# Altium schematic sheet EIS_Main_Akku.SchDoc: EIS: Akkulader und Überwachung
size A4; FaxNumber: +49 7721 943 210; Organization: Hahn-Schickard; Address1: Wilhelm-Schickard-Str. 10; Address2: 78052 Villingen-Schwenningen; Address3: Bernd.Ehrbrecht@Hahn-Schickard.de; DocumentNumber: 1; Revision: 1.0; SheetNumber: 4; SheetTotal: 7; PhoneNumber: 0 7721 943 137; E-Mail: Xxxx.Xxxx@Hahn-Schickard.de; PageSetup: Record=PageOptions|CenterHorizontal=True|CenterVertical=True|PrintScale=0.97|XCorrection=1.00|YCorrection=1.00|PrintKind=0|BorderSize=5000000|LeftOffset=0|BottomOffset=0|Orientation=2|PaperLength=1000|PaperWidth=1000|Scale=100|PaperSource=7|PrintQuality=-3|MediaType=1|DitherType=10|PrintScaleMode=1|PaperKind=A4|PaperIndex=9; ProjectName: Project File Name
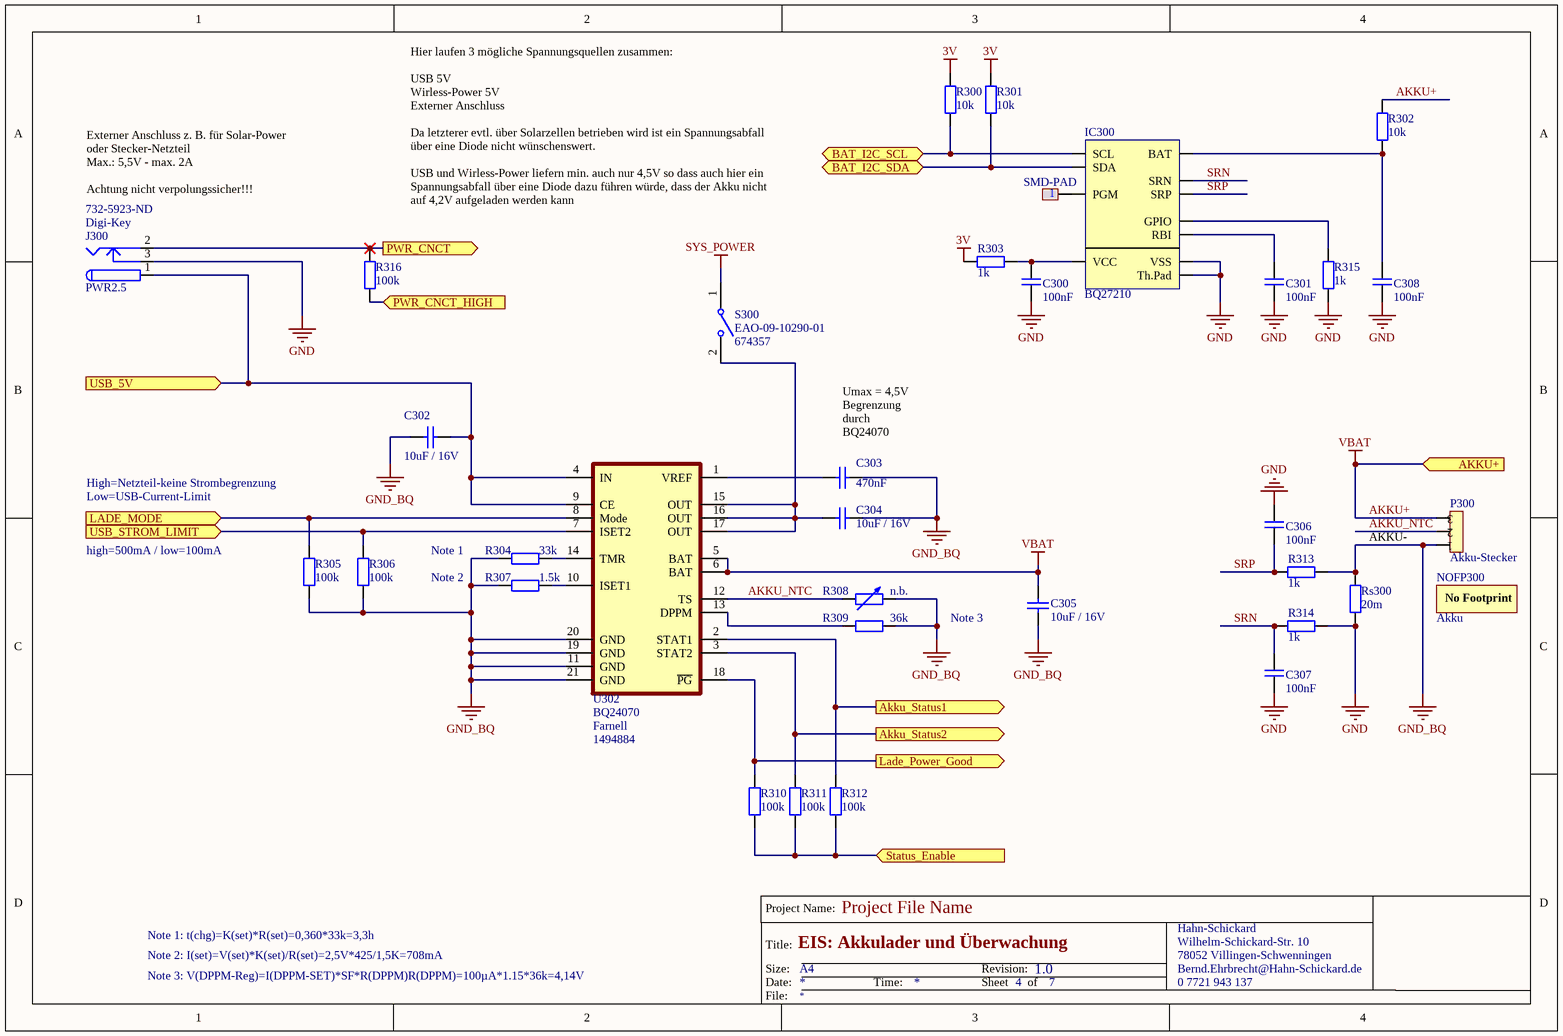
[diagram p0: EIS_Main_Akku.SchDoc]

## Parts
C300  100nF  [CAPC1608N]
C301  100nF  [CAPC1608N]
C302  10uF / 16V  [CAPC2012N]
C303  470nF  [CAPC1608N]
C304  10uF / 16V  [CAPC2012N]
C305  10uF / 16V  [CAPC2012N]
C306  100nF  [CAPC1608N]
C307  100nF  [CAPC1608N]
C308  100nF  [CAPC1608N]
IC300  BQ27210  [TI-DRK-PVSON]
J300  PWR2.5  Supplier 1: Digi-Key  Supplier Part Number 1: 732-5923-ND  [WE_694102304002]
NOFP300  value Akku  [No_Footprint]  (hidden comment: No-Footprint)
P300  Akku-Stecker  [S3B-XH-A]
R300  10k  [RESC1608N]
R301  10k  [RESC1608N]
R302  10k  [RESC1608N]
R303  1k  [RESC1608N]
R304  33k  [RESC1608N]
R305  100k  [RESC1608N]
R306  100k  [RESC1608N]
R307  1.5k  [RESC1608N]
R308  n.b.  [RESC1608N]
R309  36k  [RESC1608N]
R310  100k  [RESC1608N]
R311  100k  [RESC1608N]
R312  100k  [RESC1608N]
R313  1k  [RESC1608N]
R314  1k  [RESC1608N]
R315  1k  [RESC1608N]
R316  100k  [RESC1608N]
Rs300  20m  [RESC3216N]
S300  EAO-09-10290-01  Supplier Part Number 1: 674357  [EAO09-10290-01]
S301  SMD-PAD  [SMD_PAD]
U302  BQ24070  Supplier 1: Farnell  Supplier Part Number 1: 1494884  [R-PVQFN50P450X350X100-20N]

## Ports
AKKU+ (in), Akku_Status1 (out), Akku_Status2 (out), BAT_I2C_SCL (bidir), BAT_I2C_SDA (bidir), LADE_MODE (in), Lade_Power_Good (out), PWR_CNCT (out), PWR_CNCT_HIGH (in), Status_Enable (in), USB_5V (in), USB_STROM_LIMIT (in)

## Nets
3V: R300.2 R301.2 R303.2
AKKU+: C305.2 P300.3 R302.2 U302.5(BAT) U302.6(BAT) ; port AKKU+  [also labelled VBAT]
GND: C300.1 C301.1 C306.1 C307.1 C308.1 IC300.3(VSS) IC300.11(Th.Pad) J300.3 R314.1 R315.2 Rs300.1
GND_BQ: C302.1 C303.2 C304.2 C305.1 P300.1 R304.1 R305.1 R306.1 R307.1 R308.2 R309.2 R313.1 Rs300.2 U302.11(GND) U302.19(GND) U302.20(GND) U302.21(GND)
SYS_POWER: S300.1(COMMON)
AKKU_NTC: P300.2 R308.1 U302.12(TS)
Akku_Status1: R312.2 U302.2(STAT1) ; port Akku_Status1
Akku_Status2: R311.2 U302.3(STAT2) ; port Akku_Status2
BAT_I2C_SCL: IC300.4(SCL) R300.1 ; port BAT_I2C_SCL
BAT_I2C_SDA: IC300.5(SDA) R301.1 ; port BAT_I2C_SDA
LADE_MODE: R305.2 U302.8(Mode) ; port LADE_MODE
Lade_Power_Good: R310.2 U302.18(~{PG}) ; port Lade_Power_Good
PWR_CNCT: J300.2 R316.2 ; port PWR_CNCT
PWR_CNCT_HIGH: R316.1 ; port PWR_CNCT_HIGH
SRN: C307.2 IC300.7(SRN) R314.2
SRP: C306.2 IC300.8(SRP) R313.2
Status_Enable: R310.1 R311.1 R312.1 ; port Status_Enable
USB_5V: C302.2 J300.1 U302.4(IN) U302.9(CE) ; port USB_5V
USB_STROM_LIMIT: R306.2 U302.7(ISET2) ; port USB_STROM_LIMIT
NetC300_2: C300.2 IC300.2(VCC) R303.1
NetC301_2: C301.2 IC300.1(RBI)
NetC303_1: C303.1 U302.1(VREF)
NetC304_1: C304.1 S300.2(NO) U302.15(OUT) U302.16(OUT) U302.17(OUT)
NetC308_2: C308.2 IC300.6(BAT) R302.1
NetIC300_9: IC300.9(GPIO) R315.1
NetIC300_10: IC300.10(PGM) S301.1
NetR304_2: R304.2 U302.14(TMR)
NetR307_2: R307.2 U302.10(ISET1)
NetR309_1: R309.1 U302.13(DPPM)

## Notes on the sheet
- Externer Anschluss z. B. für Solar-Power
  oder Stecker-Netzteil
  Max.: 5,5V - max. 2A
  Achtung nicht verpolungssicher!!!
- Hier laufen 3 mögliche Spannungsquellen zusammen:
  USB 5V
  Wirless-Power 5V
  Externer Anschluss
  Da letzterer evtl. über Solarzellen betrieben wird ist ein Spannungsabfall über eine Diode nicht wünschenswert.
  USB und Wirless-Power liefern min. auch nur 4,5V so dass auch hier ein Spannungsabfall über eine Diode dazu führen würde, dass der Akku nicht auf 4,2V aufgeladen werden kann
- (near C303) Umax = 4,5V
  Begrenzung
  durch
  BQ24070
- Low=USB-Current-Limit
- High=Netzteil-keine Strombegrenzung
- high=500mA / low=100mA
- Note 2
- Note 1
- AKKU-
- Note 3
- Note 1: t(chg)=K(set)*R(set)=0,360*33k=3,3h
- Note 2: I(set)=V(set)*K(set)/R(set)=2,5V*425/1,5K=708mA
- Note 3: V(DPPM-Reg)=I(DPPM-SET)*SF*R(DPPM)R(DPPM)=100µA*1.15*36k=4,14V
- Project Name:
- Size:
- Date:
- Title:
- A4
- Time:
- Revision:
- Sheet
- of
- File:
- (in symbol No-Footprint) No Footprint

## Library data of the parts
C300 C301 C306-C308 = Kondensator SMD Keramik: 07_Lieferant: Digi-Key; 08_Lieferanten_Nummer: 399-1096-1-ND
C302 C304 C305 = C0805: Ceramic Chip Capacitor - Standard; Note: Footprint corresponds to dimensions for bulk cassette packaging. This case size has tightened tolerances.; 07_Lieferant: Digi-Key; 08_Lieferanten_Nummer: 490-6473-1-ND; Published: 17-Jul-2002; LatestRevisionDate: 19-Mar-2004; LatestRevisionNote: Silkscreen size reduced.; DatasheetDocument: Mar-2001; PackageDocument: Mar-2001; PackageReference: 0805; Publisher: Altium Limited; Code_JEITA: 0805; Code_IPC: 2012[0805]; ComponentLink1Description: Manufacturer Link; ComponentLink1URL: http://www.kemet.com/; ComponentLink2Description: Datasheet; ComponentLink2URL: http://www.kemet.com/kemet/web/homepage/kechome.nsf/vapubfilesname/F3102TA.pdf/$file/F3102TA.pdf; Value: 10uF / 16V
C303 = C0805: Ceramic Chip Capacitor - Standard; Note: Footprint corresponds to dimensions for bulk cassette packaging. This case size has tightened tolerances.; 07_Lieferant: Digi-Key; 08_Lieferanten_Nummer: 445-5152-1-ND; Published: 17-Jul-2002; LatestRevisionDate: 19-Mar-2004; LatestRevisionNote: Silkscreen size reduced.; DatasheetDocument: Mar-2001; PackageDocument: Mar-2001; PackageReference: 0805; Publisher: Altium Limited; Code_JEITA: 0805; Code_IPC: 2012[0805]; ComponentLink1Description: Manufacturer Link; ComponentLink1URL: http://www.kemet.com/; ComponentLink2Description: Datasheet; ComponentLink2URL: http://www.kemet.com/kemet/web/homepage/kechome.nsf/vapubfilesname/F3102TA.pdf/$file/F3102TA.pdf; Value: 470nF
IC300 = BQ27210: i-Ion AND Li-Pol BATTERY GAS GAUGE IC FOR PORTABLE APPLICATIONS; 08_Lieferanten_Nummer: 296-21511-1-ND; 07_Lieferant: Digi-Key; 05_Datasheet_Link_Lokal: Path and File; 10_Erstell_Datum: DD.MM.YYYY; 09_Ersteller: HSG Name; 02_Herstellerbezeichnung: ka; 03_Hersteller_Link: Link; 04_Datasheet_Link: Datasheet; 06 Footprint_Link_Lokal: Path and File
J300 = PWR2.5: Low Voltage Power Supply Connector; Published: 17-Dec-2003; DatasheetDocument: 09-May-2002; Publisher: Altium Limited; ComponentLink1Description: Manufacturer Link; ComponentLink1URL: http://domino.kycon.com/internet/Products.html; 07_Lieferant: Digi-Key; 08_Lieferanten_Nummer: 732-5923-ND
NOFP300 = No-Footprint: Dummy-Bauteil, um Zusatzbestellungen in die BOM einzutragen; 07_Lieferant: Farnell; 08_Lieferanten_Nummer: 2401853
P300 = Header 3X1: Header, 3-Pin; 08_Lieferanten_Nummer: 1516290; 07_Lieferant: Farnell; LatestRevisionDate: 17-Jul-2002; LatestRevisionNote: Re-released for DXP Platform.; Publisher: Altium Limited
R300-R302 = Res2: Resistor; 07_Lieferant: Digi-Key; 08_Lieferanten_Nummer: 311-10KGRCT-ND; Published: 8-Jun-2000; LatestRevisionDate: 17-Jul-2002; LatestRevisionNote: Re-released for DXP Platform.; PackageReference: AXIAL-0.4; Publisher: Altium Limited; Value: 10k
R303 R313-R315 = Res2: Resistor; 07_Lieferant: Farnell; 08_Lieferanten_Nummer: 2309108; Published: 8-Jun-2000; LatestRevisionDate: 17-Jul-2002; LatestRevisionNote: Re-released for DXP Platform.; PackageReference: AXIAL-0.4; Publisher: Altium Limited; Value: 1k
R304 = Res2: Resistor; 07_Lieferant: Digi-Key; 08_Lieferanten_Nummer: 311-33KGRCT-ND; Published: 8-Jun-2000; LatestRevisionDate: 17-Jul-2002; LatestRevisionNote: Re-released for DXP Platform.; PackageReference: AXIAL-0.4; Publisher: Altium Limited; Value: 33k
R305 R306 R310-R312 R316 = Res2: Resistor; 07_Lieferant: Digi-Key; 08_Lieferanten_Nummer: 311-100KGRCT-ND; Published: 8-Jun-2000; LatestRevisionDate: 17-Jul-2002; LatestRevisionNote: Re-released for DXP Platform.; PackageReference: AXIAL-0.4; Publisher: Altium Limited; Value: 100k
R307 = Res2: Resistor; 07_Lieferant: Digi-Key; 08_Lieferanten_Nummer: RG16P1.5KBTR-ND; Published: 8-Jun-2000; LatestRevisionDate: 17-Jul-2002; LatestRevisionNote: Re-released for DXP Platform.; PackageReference: AXIAL-0.4; Publisher: Altium Limited; Value: 1.5k
R308 = Res Adj2: Variable Resistor; Set Position: 0.5; Published: 8-Jun-2000; LatestRevisionDate: 17-Jul-2002; LatestRevisionNote: Re-released for DXP Platform.; PackageReference: AXIAL-0.6; Publisher: Altium Limited; Value: n.b.; Supplier 1: Farnell; Supplier Part Number 1: 1672343
R309 = Res2: Resistor; 07_Lieferant: Digi-Key; 08_Lieferanten_Nummer: 311-36KGRCT-ND; Published: 8-Jun-2000; LatestRevisionDate: 17-Jul-2002; LatestRevisionNote: Re-released for DXP Platform.; PackageReference: AXIAL-0.4; Publisher: Altium Limited; Value: 36k
Rs300 = RESC1005N (R0402): Suplier: Seller; Suplier Ordering Number: Ordering Number; 07_Lieferant: Farnell; 08_Lieferanten_Nummer: 1462292; Published: 14.08.2009; Publisher: HSG Jürgen Merz; Value: 20m; ComponentLink1Description: RESC1005N (R0402) 1%
S300 = Schalter universal 1Polig: 01_Hersteller: Manufaktor Link; 05_Datasheet_Link_Lokal: Path and File; 10_Erstell_Datum: DD-MM-YYYY; 09_Ersteller: HSG Name; 02_Herstellerbezeichnung: ka; 07_Lieferant: Farnell; 03_Hersteller_Link: Link; 04_Datasheet_Link: Datasheet; 06 Footprint_Link_Lokal: Path and File; Supplier 1: Farnell; 08_Lieferanten_Nummer: 674357
S301 = SMD_PAD: SMD-PAD für Debugvorgang
U302 = BQ24070: Lithum Ion Ladebaustein, Power Path; 07_Lieferant: Farnell; 08_Lieferanten_Nummer: 1494884